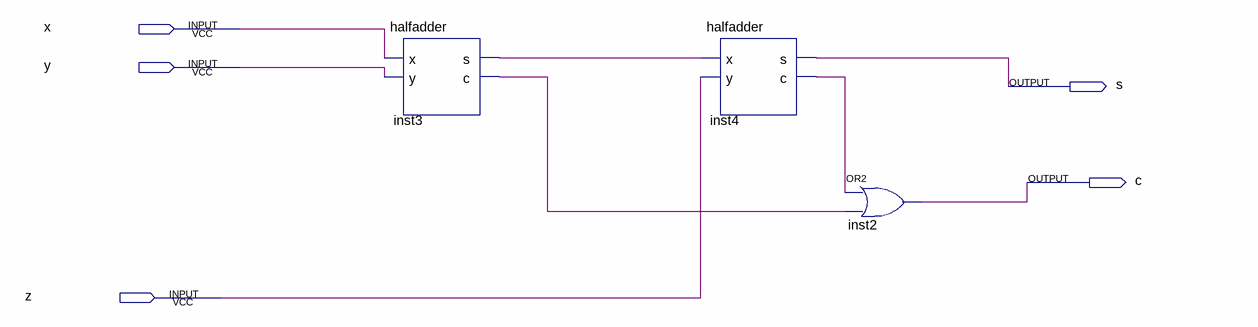
[diagram p0: schematic sheet]
// Quartus schematic fulladder.bdf as structural Verilog: 3 symbols, 5 pins
module fulladder (
  input  x,
  input  y,
  input  z,
  output s,
  output c
);

  wire inst3_c, inst3_s, inst4_c;

  halfadder inst3 (.x(x), .y(y), .s(inst3_s), .c(inst3_c));
  halfadder inst4 (.x(inst3_s), .y(z), .s(s), .c(inst4_c));
  or inst2 (c, inst4_c, inst3_c);
endmodule
